# EAGLE design DaisyChainv2 (EAGLE 9.6.2)
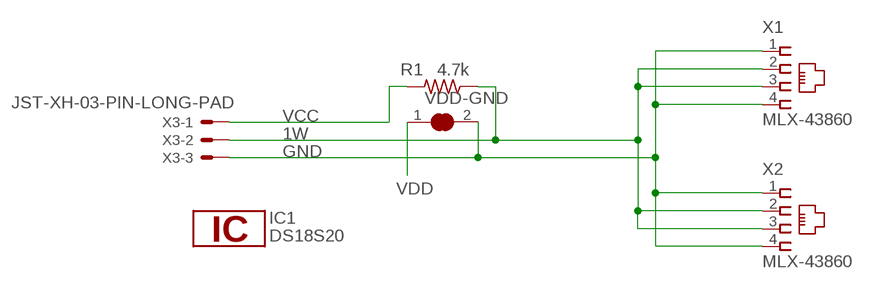
[diagram p0: schematic, sheet 1]

## Parts
IC1  DS18S20  [TO92-]
R1  4.7k  R-US_0207/10  [0207/10]
VDD-GND  SJW-SHORTED  [SJW-SHORTED]
X1  MLX-43860  [MLX-43860]
X2  MLX-43860  [MLX-43860]
X3  JST-XH-03-PIN-LONG-PAD  [JST-XH-03-PACKAGE-LONG-PAD]

## Nets
1W: R1.1 X1.2 X1.3 X2.2 X2.3 X3.2
GND: VDD-GND.2 X1.1 X1.4 X2.1 X2.4 X3.3
VCC: R1.2 X3.1
VDD: VDD-GND.1

## Power pins joined to a net without a drawn wire
1W: IC1.2
GND: IC1.1
VDD: IC1.3

## Library data of the parts
IC1 = 1wire:DS18S20: High Precision Digital Thermometer This chip provides a onewire thermosensor with approx. 0.5°C accuracy.A programmable over/undertemperure alarm is available. Notes: Vdd must be applied for accurate measurements at low temperatures, as the parasite power circuit otherwise heats the sensor. If parasite power is used, Vdd has to be connected to GND. The DS1822 is a low-cost thermometer chip, the DS18B20 is similar to the DS18S20, but with 9..12 Bit programmable precision. Author: Jan Kandziora <jjj@gmx.de>
R1 = adafruit:R-US_: RESISTOR, American symbol
VDD-GND = home:SJW-SHORTED: SMD solder JUMPER
X1 X2 = home:MLX-43860: RJ11 Connector Source: MOLEX 43860-003; FAM: 43860; MF: MOLEX; VAR: 0003
X3 = Rembrandt Electronics - JST XH Connectors v1-0:JST-XH-03-PIN: JST XH Connector 2 Pin Wire to board connector. Pitch: 2,54 mm, (0.100") Number of pins: 3 Created by Rembrandt Electronics www.rembrandtelectronics.com

## Net classes
0 default: width 0.203 mm

## Board
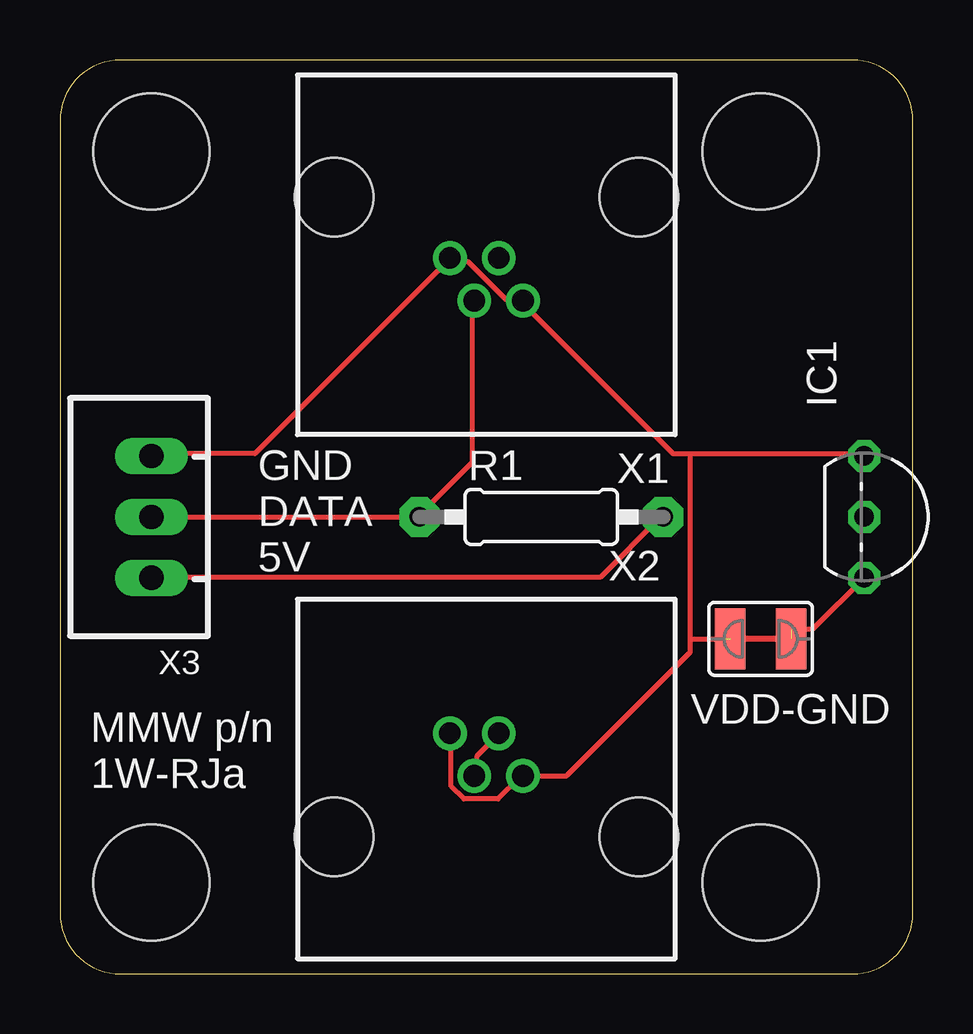
[diagram p1: board, top side]
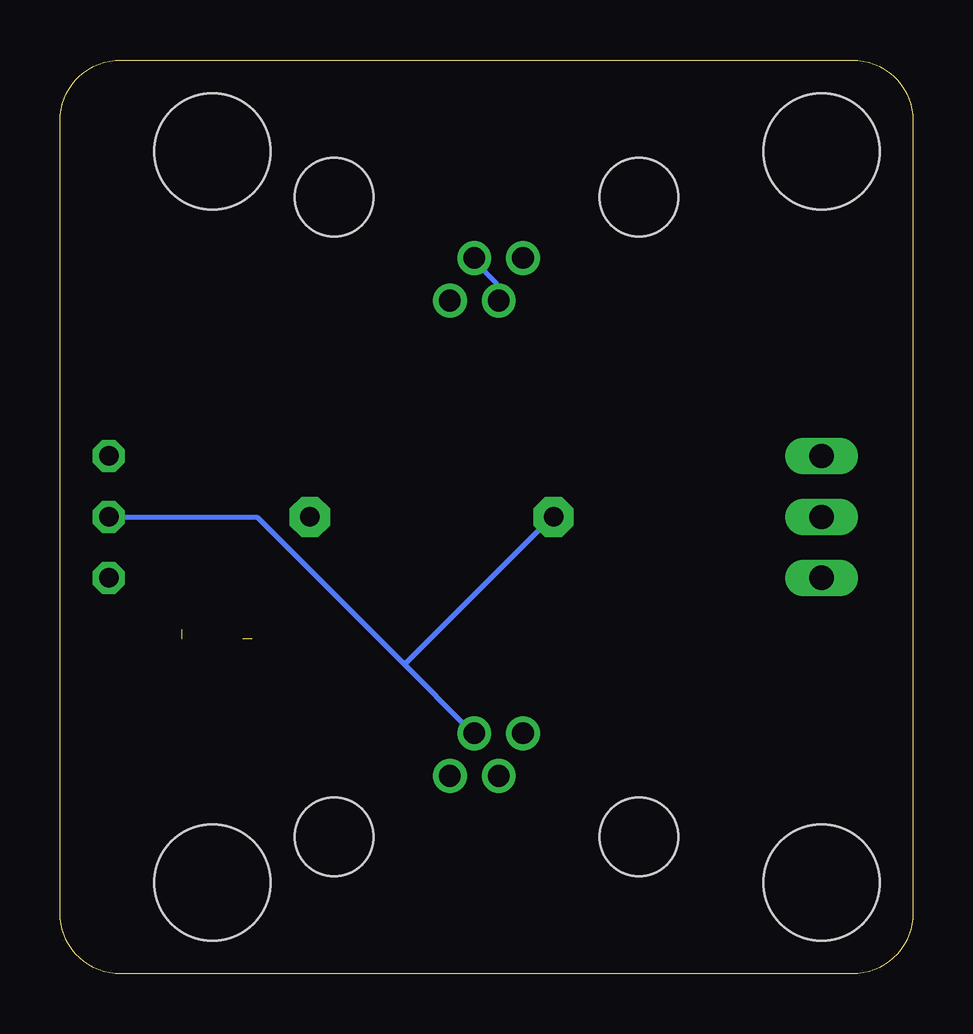
[diagram p2: board, bottom side, seen from below]

Size 35.56 x 38.1 mm. Coordinates in mm from the lower left corner, seen from the top.
Outline: 0,35.56 0,2.54 arc90 2.54,0 33.02,0 arc90 35.56,2.54 35.56,35.56 arc90 33.02,38.1 2.54,38.1 arc90 0,35.56
Copper layers (1*16): Top 0.035mm / dielectric 1.5mm / Bottom 0.035mm
Design rules "default *": minimum track width 8mil, minimum drill 0.35mm, track to track 6mil, track to pad 6mil, pad to pad 6mil, via to via 6mil, smd to smd 6mil, copper to edge 40mil, drill to drill 6mil, minimum pad ring 10mil, minimum via ring 8mil, stop-mask expansion 4mil, vias tented up to drill 0mil, thermal gap 10mil
Holes 4.83 mm at 3.81,34.29 3.81,3.81 29.21,34.29 29.21,3.81

### Footprints (pad centres in the part's own frame; a part is rotated, then mirrored left to right if it is on the bottom)
TO92- = drill 0.813 octagon: 1 -2.54,0; 2 0,0; 3 2.54,0
0207/10 = drill 0.813 pad 1.676 octagon: 1 -5.08,0; 2 5.08,0
SJW-SHORTED = smd 1.27 x 2.54: 1 -1.27,0; 2 1.27,0
MLX-43860 = drill 0.9 pad 0.914: 1 1.524,0.127; 2 0.508,1.905; 3 -0.508,0.127; 4 -1.524,1.905 | hole 3.277: -6.35,-2.413; 6.35,-2.413
JST-XH-03-PACKAGE-LONG-PAD = drill 1.016 long: 1 -2.54,0; 2 0,0; 3 2.54,0

### Placement (x,y rotation side)
IC1  33.53,19.05 270 top
R1  20.07,19.05 0 top
VDD-GND  29.21,13.97 180 top
X1  17.78,29.97 180 top
X2  17.78,8.13 0 top
X3  3.81,19.05 90 top

### Tracks (layer width: path | path; a pad name or v marks a point on that pad's centre or on a via)
1W
  Top 0.203: X3.2 3.86,19.02 14.88,19.02 R1.1 15.06,19.2 17.2,21.34 17.2,27.91 X1.2 | X2.3 17.37,8.36 17.37,9.07 18.26,9.96 X2.2
  Bottom 0.203: X1.2 17.37,28.09 17.37,28.8 18.26,29.69 X1.3 | 21.29,12.98 18.44,10.13 X2.2 | 21.29,12.98 27.33,19.02 33.38,19.02 IC1.2 | 21.29,12.98 21.11,12.98 15.06,19.02 R1.1
GND  (1 unrouted)
  Top 0.203: X2.4 16.31,9.96 16.31,7.82 16.84,7.29 18.26,7.29 19.15,8.18 X2.1 21.11,8.25 26.26,13.41 26.26,13.97 | 26.26,21.69 25.55,21.69 19.33,27.91 X1.4 19.15,28.09 18.62,28.09 17.02,29.69 16.31,29.69 X1.1 16.13,29.69 8.13,21.69 3.86,21.69 X3.3 | 26.26,21.69 33.38,21.69 IC1.1 | 26.26,21.69 26.26,13.97 | 26.26,13.97 27.56,13.97
VCC
  Top 0.203: X3.1 3.86,16.54 22.53,16.54 25.02,19.02 R1.2
VDD  (1 unrouted)
  Top 0.203: IC1.3 31.37,14.35 30.48,14.35

### Text on the board
tPlace: GND / DATA / 5V | MMW p/n / 1W-RJa